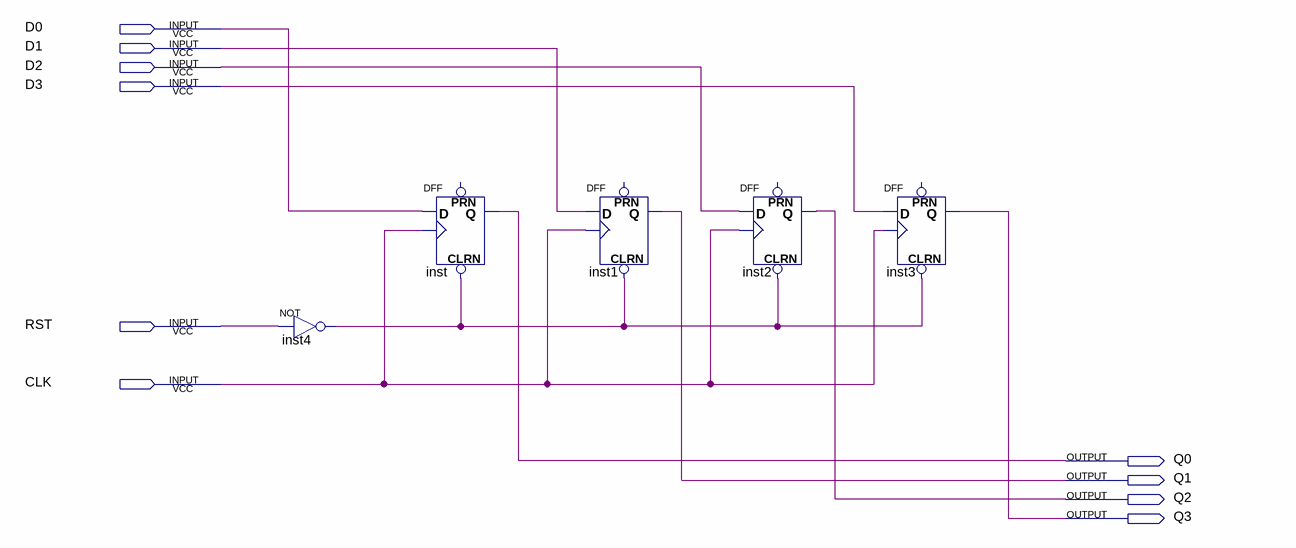
[diagram p0: schematic sheet]
// Quartus schematic register_4bits.bdf as structural Verilog: 5 symbols, 10 pins
module register_4bits (
  input  D0,
  input  D1,
  input  D2,
  input  D3,
  input  RST,
  input  CLK,
  output Q0,
  output Q1,
  output Q2,
  output Q3
);

  wire inst4_out;

  not inst4 (inst4_out, RST);
  DFF inst (.CLRN(inst4_out), .CLK(CLK), .D(D0), .Q(Q0));  // open: PRN
  DFF inst1 (.CLRN(inst4_out), .CLK(CLK), .D(D1), .Q(Q1));  // open: PRN
  DFF inst2 (.CLRN(inst4_out), .CLK(CLK), .D(D2), .Q(Q2));  // open: PRN
  DFF inst3 (.CLRN(inst4_out), .CLK(CLK), .D(D3), .Q(Q3));  // open: PRN
endmodule
